# EasyEDA Pro project ProPrj_Hitboard 功能键小板_2026-02-21.epro

# Board PCB1
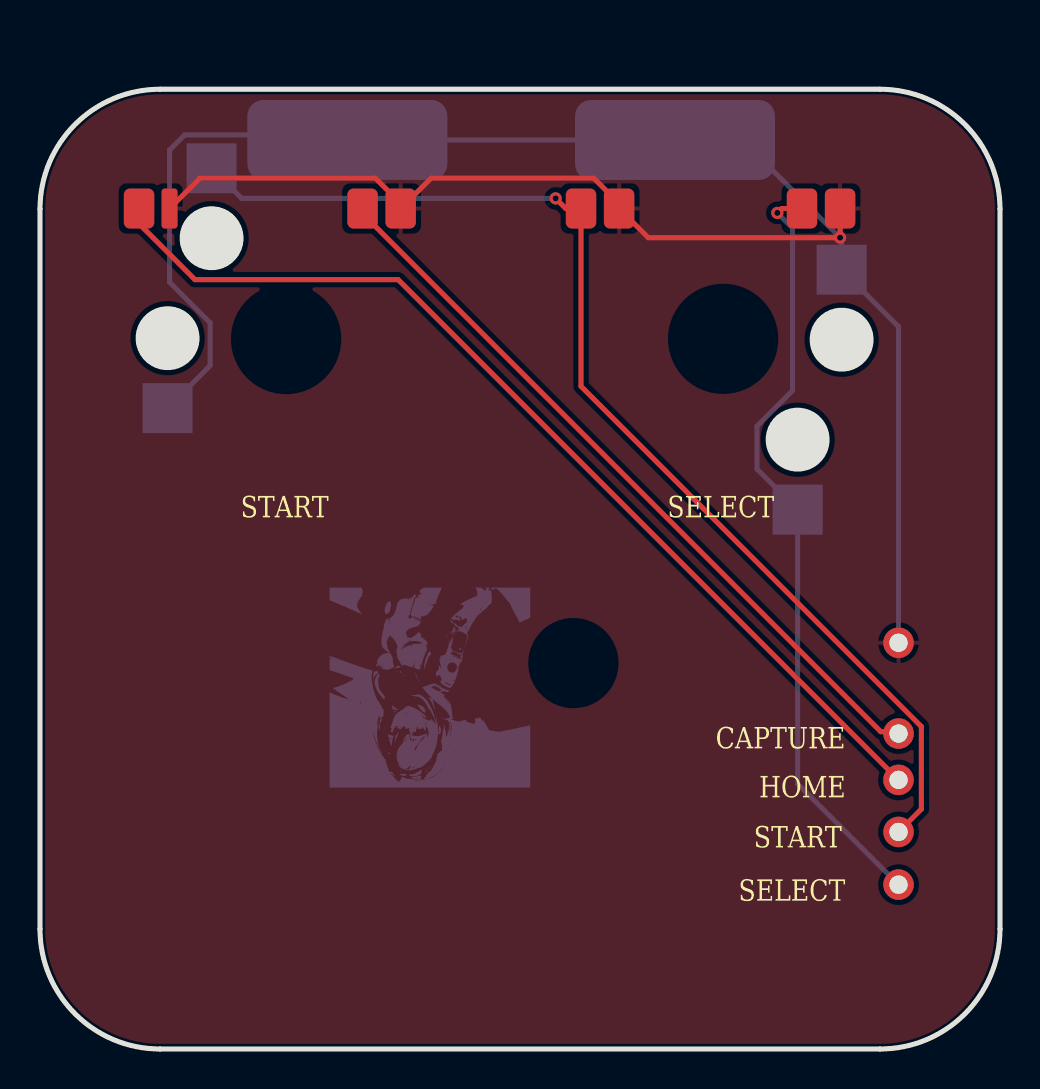
[diagram p0: board, top side]
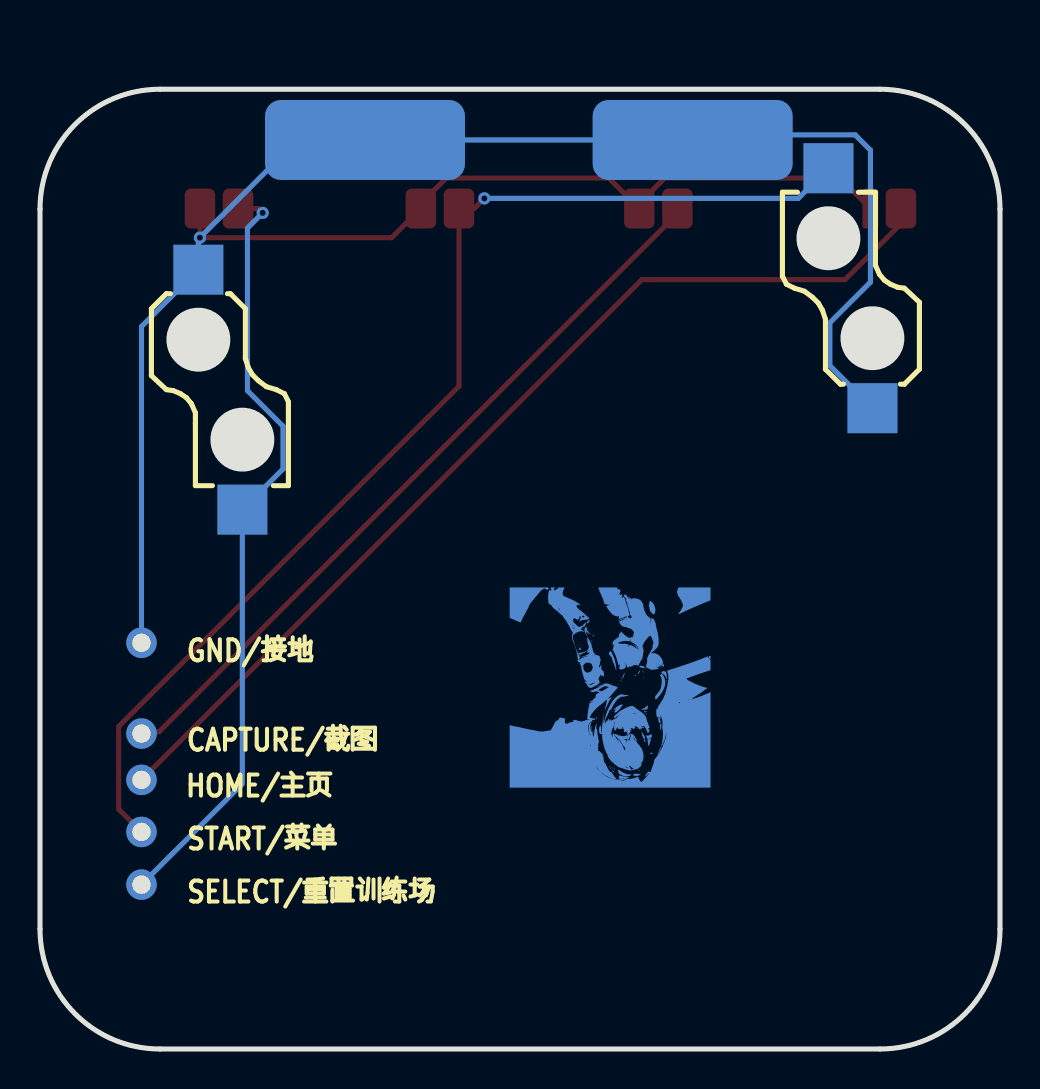
[diagram p1: board, bottom side, seen from below]

Outline 48 x 48 mm; copper layers: Top Layer, Bottom Layer. Coordinates in mm from the lower left corner of the outline.
Outline path: 0,42 0,6 arc(1.76,1.76) 6,0 42,0 arc(46.24,1.76) 48,6 48,42 arc(46.24,46.24) 42,48 6,48 arc(1.76,46.24) 0,42
Stack: Top Layer 0.035mm / Dielectric1 1.51mm FR4 er 4.5 / Bottom Layer 0.035mm

## Design rules (mm)
template: JLCPCB Capability(Two Layers Board)
spacing copperThickness1oz (default): track to track 0.102, other pairs 0.152 to 0.3
spacing copperThickness2oz: track to track 0.203, other pairs 0.152 to 0.3
track width copperThickness1oz (default): min 0.127, default 0.254, max 2.54
track width copperThickness2oz: min 0.203, default 0.254, max 2.54
differential pair differentialPair (default): width min 0.127, default 0.254, max 2.54; gap min 0.152, default 0.152
via viaSize (default): diameter min 0.5, default 0.61, max 10; hole min 0.3, default 0.305, max 6.3

## Placement (name value [footprint] x y rotation side)
NOREF  -  [Pad_e80]  28.96 42.03 0 top
NOREF#2  -  [Pad_e47]  18.03 42.03 0 top
NOREF#3  -  [Pad_e56]  6.48 42.03 0 top
NOREF#4  -  [Pad_e16]  42.93 13.46 90 top
NOREF#5  -  [Pad_e83]  38.1 42.03 0 top
NOREF#6  -  [Pad_e81]  27.05 42.03 0 top
NOREF#7  -  [Pad_e17]  42.93 15.78 90 top
NOREF#8  -  [Pad_e44]  16.13 42.03 0 top
NOREF#9  -  [Pad_e82]  40 42.03 0 top
NOREF#10  -  [Pad_e284]  31.75 45.46 0 top
NOREF#11  -  [Pad_e19]  42.93 10.86 90 top
NOREF#12  -  [Pad_e8272]  42.93 20.32 90 top
NOREF#13  -  [Pad_e67]  4.95 42.03 0 top
NOREF#14  -  [Pad_e286]  15.37 45.46 0 top
NOREF#15  -  [Pad_e18]  42.93 8.22 90 top
U6  -  [CONN-SMD_HOTPLUGPAKAGE__C9900010116-1]  7.48 38.05 270 bottom
U6#2  -  [CONN-SMD_HOTPLUGPAKAGE__C9900010116-1]  38.98 32.97 90 bottom

## Footprints (pads in the part's own frame, mm; a bottom-side part is the same pattern mirrored in y, then rotated)
CONN-SMD_HOTPLUGPAKAGE__C9900010116-1
  rect 2.5x2.5 smd: 1(-6,-1.1) 2(6,1.1)
Pad_e16
  round 1.524 hole 0.914: 2(0,0)
Pad_e17
  round 1.524 hole 0.914: 2(0,0)
Pad_e18
  round 1.524 hole 0.914: 2(0,0)
Pad_e19
  round 1.524 hole 0.914: 2(0,0)
Pad_e44
  rrect 1.524x2 smd: 1(0,0)
Pad_e47
  rrect 1.524x2 smd: 1(0,0)
Pad_e56
  rrect 0.8x2 smd: 1(0,0)
Pad_e67
  rrect 1.524x2 smd: 1(0,0)
Pad_e80
  rrect 1.524x2 smd: 1(0,0)
Pad_e81
  rrect 1.524x2 smd: 1(0,0)
Pad_e82
  rrect 1.524x2 smd: 1(0,0)
Pad_e83
  rrect 1.524x2 smd: 1(0,0)
Pad_e284
  rrect 10x4 smd far side: 1(0,0)
Pad_e286
  rrect 10x4 smd far side: 1(0,0)
Pad_e8272
  round 1.524 hole 0.914: 2(0,0)

## Nets
GND: NOREF.1 NOREF#2.1 NOREF#3.1 NOREF#9.1 NOREF#10.1 NOREF#12.2 NOREF#14.1 U6.2 U6#2.2
CAPTURE: NOREF#7.2 NOREF#8.1
HOME: NOREF#4.2 NOREF#13.1
SELECT: NOREF#5.1 NOREF#15.2 U6#2.1
START: NOREF#6.1 NOREF#11.2 U6.1

## Via types
v1: diameter 0.61, hole 0.305, Top Layer to Bottom Layer, 3 vias

## Routing (per net, layer and track width the routed paths; a pad name or vN(x,y) marks a point on that pad's centre or on a via; arc(x,y) is an arc through that point)
GND: length 110.6
  Top Layer w0.254: v1(40,40.58) 40,40.83 ; 40,40.83 NOREF#9.1 ; 40,40.83 39.75,40.58 30.41,40.58 NOREF.1 28.96,42.29 27.69,43.56 19.56,43.56 NOREF#2.1 18.03,42.29 16.76,43.56 8,43.56 NOREF#3.1
  Bottom Layer w0.254: U6.2 8.51,34.18 8.51,36.32 6.48,38.35 6.48,44.95 7.24,45.72 15.11,45.72 NOREF#14.1 NOREF#10.1 35.12,45.46 v1(40,40.58) 40.08,40.5 U6#2.2 42.93,36.13 NOREF#12.2
CAPTURE: length 37.8
  Top Layer w0.254: NOREF#8.1 16.13,41.78 42.04,15.87 42.83,15.87 NOREF#7.2
HOME: length 50.3
  Top Layer w0.254: NOREF#4.2 17.91,38.48 7.75,38.48 4.95,41.27 NOREF#13.1
SELECT: length 38.9
  Top Layer w0.254: v1(36.87,41.82) 37.08,42.03 NOREF#5.1
  Bottom Layer w0.254: v1(36.87,41.82) 37.63,41.05 37.63,32.93 35.85,31.15 35.85,29.01 U6#2.1 37.88,13.27 NOREF#15.2
START: length 58
  Top Layer w0.254: NOREF#11.2 44.07,12 44.07,16.13 27.05,33.14 NOREF#6.1 26.29,42.03 v1(25.78,42.54)
  Bottom Layer w0.254: v1(25.78,42.54) 10.09,42.54 U6.1

## Copper pours and planes (outline as drawn; the poured copper is in the pictures)
GND on Top Layer: -2.16,50.92 50.93,50.92 50.93,-2.42 -2.16,-2.42

Small or netless copper shapes (teardrops, artwork), in the pictures only: 117 on Bottom Layer

## Text on the board
Bottom Silkscreen Layer: START/菜单 | SELECT/重置训练场 | GND/接地 | CAPTURE/截图 | HOME/主页
Top Silkscreen Layer: START | SELECT | CAPTURE | HOME
